# EAGLE design Mosfet Board (EAGLE 9.5.1)
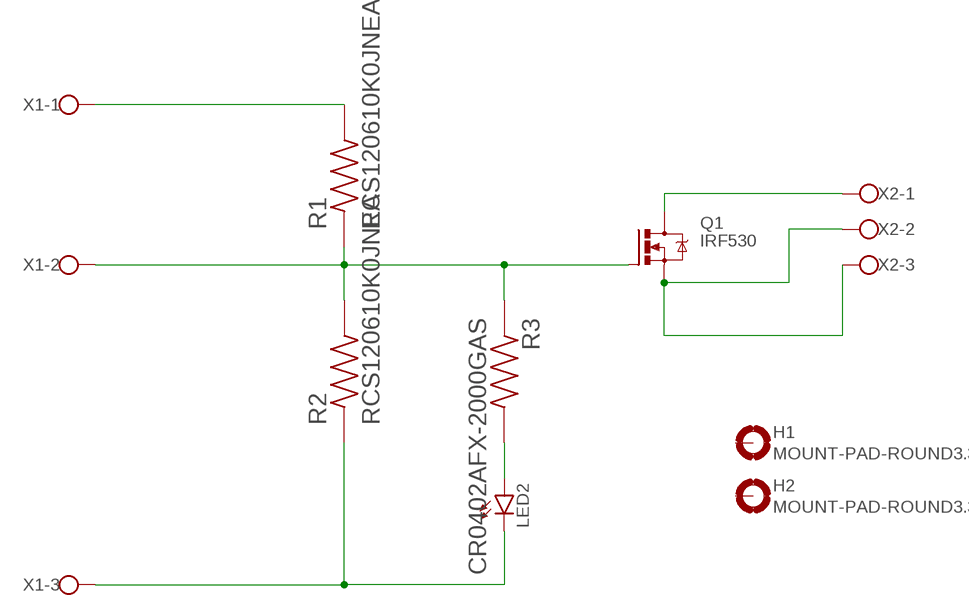
[diagram p0: schematic, sheet 1]

## Parts
H1  MOUNT-PAD-ROUND3.3  [3,3-PAD]
H2  MOUNT-PAD-ROUND3.3  [3,3-PAD]
LED2  LED  [SMARTLED-TTW]
Q1  IRF530  [TO220BV]
R1  RCS120610K0JNEA  [RESC3116X65N]
R2  RCS120610K0JNEA  [RESC3116X65N]
R3  CR0402AFX-2000GAS  [RESC1005X37N]
X1  W237-103  [W237-103]
X2  W237-103  [W237-103]

## Nets
N$1: Q1.D X2.1
N$2: Q1.S X2.2 X2.3
N$3: Q1.G R1.1 R2.2 R3.1 X1.2
N$4: LED2.C@1(C) R2.1 X1.3
N$5: R1.2 X1.1
N$6: LED2.A@1(A) R3.2
Unconnected: H1.B3,3(MOUNT) H2.B3,3(MOUNT)

## Library data of the parts
H1 H2 = holes:MOUNT-PAD-ROUND: MOUNTING PAD, round
LED2 = led:LED: LED OSRAM: - CHIPLED LG R971, LG N971, LY N971, LG Q971, LY Q971, LO R971, LY R971 LH N974, LH R974 LS Q976, LO Q976, LY Q976 LO Q996 - Hyper CHIPLED LW Q18S LB Q993, LB Q99A, LB R99A - SideLED LS A670, LO A670, LY A670, LG A670, LP A670 LB A673, LV A673, LT A673, LW A673 LH A674 LY A675 LS A676, LA A676, LO A676, LY A676, LW A676 LS A679, LY A679, LG A679 - Hyper Micro SIDELED® LS Y876, LA Y876, LO Y876, LY Y876 LT Y87S - SmartLED LW L88C, LW L88S LB L89C, LB L89S, LG L890 LS L89K, LO L89K, LY L89K LS L896, LA L896, LO L896, LY L896 - TOPLED LS T670, LO T670, LY T670, LG T670, LP T670 LSG T670, LSP T670, LSY T670, LOP T670, LYG T670 LG T671, LOG T671, LSG T671 LB T673, LV T673, LT T673, LW T673 LH T674 LS T676, LA T676, LO T676, LY T676, LB T676, LH T676, LSB T676, LW T676 LB T67C, LV T67C, LT T67C, LS T67K, LO T67K, LY T67K, LW E67C LS E67B, LA E67B, LO E67B, LY E67B, LB E67C, LV E67C, LT E67C LW T67C LS T679, LY T679, LG T679 LS T770, LO T770, LY T770, LG T770, LP T770 LB T773, LV T773, LT T773, LW T773 LH T774 LS E675, LA E675, LY E675, LS T675 LS T776, LA T776, LO T776, LY T776, LB T776 LHGB T686 LT T68C, LB T68C - Hyper Mini TOPLED® LB M676 - Mini TOPLED Santana® LG M470 LS M47K, LO M47K, LY M47K Source: http://www.osram.convergy.de LUXEON: - LUMILED® LXK2-PW12-R00, LXK2-PW12-S00, LXK2-PW14-U00, LXK2-PW14-V00 LXK2-PM12-R00, LXK2-PM12-S00, LXK2-PM14-U00 LXK2-PE12-Q00, LXK2-PE12-R00, LXK2-PE12-S00, LXK2-PE14-T00, LXK2-PE14-U00 LXK2-PB12-K00, LXK2-PB12-L00, LXK2-PB12-M00, LXK2-PB14-N00, LXK2-PB14-P00, LXK2-PB14-Q00 LXK2-PR12-L00, LXK2-PR12-M00, LXK2-PR14-Q00, LXK2-PR14-R00 LXK2-PD12-Q00, LXK2-PD12-R00, LXK2-PD12-S00 LXK2-PH12-R00, LXK2-PH12-S00 LXK2-PL12-P00, LXK2-PL12-Q00, LXK2-PL12-R00 Source: www.luxeon.com KINGBRIGHT: KA-3528ASYC Source: www.kingbright.com
Q1 = transistor-power:IRF530: HEXFET Power MOSFET
R1 R2 = RCS120610K0JNEA:RCS120610K0JNEA; AVAILABILITY: Unavailable; DESCRIPTION: RCS1206 200 10K 5% ET1 E3; MF: Vishay; MP: RCS120610K0JNEA; PACKAGE: 3116 Vishay; PRICE: None
R3 = CR0402AFX-2000GAS:CR0402AFX-2000GAS; AVAILABILITY: Unavailable; DESCRIPTION: ResA-AS 0402 200R 1% 63mW TC100; MF: Bourns; MP: CR0402AFX-2000GAS; PACKAGE: 1005 Bourns; PRICE: None
X1 X2 = con-wago-500:W237-103: WAGO SCREW CLAMP; MPN: 237-103; OC_FARNELL: unknown; OC_NEWARK: 18M7116

## Board
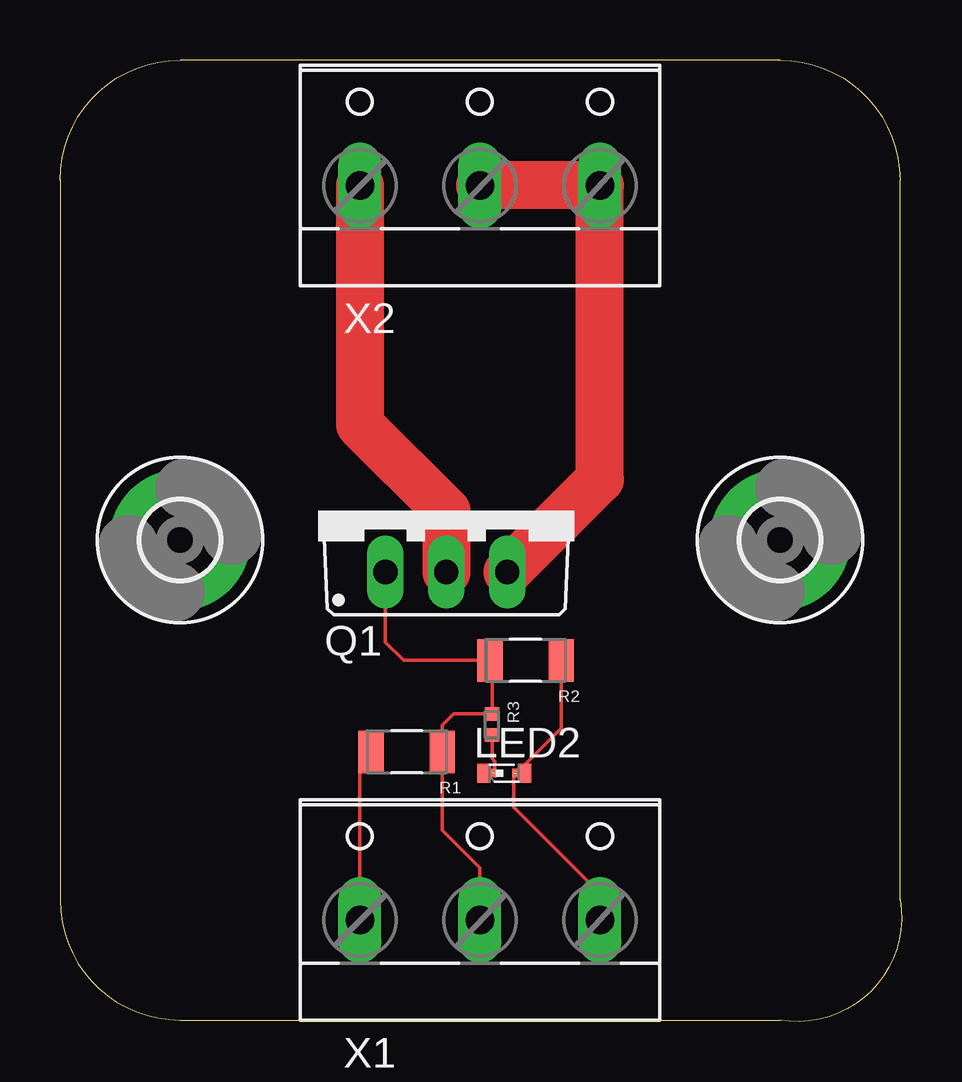
[diagram p1: board, top side]

Size 35.06 x 40.06 mm. Coordinates in mm from the lower left corner, seen from the top.
Outline: 5,0.06 30,0.06 arc110 35,5.06 35,35.06 arc90 30,40.06 5,40.06 arc90 0,35.06 0,5.06 arc90 5,0.06
Copper layers (1*16): Top 0.035mm / dielectric 1.5mm / Bottom 0.035mm
Design rules "default": minimum track width 6mil, minimum drill 0.35mm, track to track 6mil, track to pad 6mil, pad to pad 6mil, via to via 6mil, smd to smd 6mil, copper to edge 40mil, drill to drill 6mil, minimum pad ring 10mil, minimum via ring 8mil, stop-mask expansion 4mil, vias tented up to drill 0mil, thermal gap 10mil

### Footprints (pad centres in the part's own frame; a part is rotated, then mirrored left to right if it is on the bottom)
3,3-PAD = drill 3.3 pad 5.842: B3,3 0,0
SMARTLED-TTW = smd 0.8 x 0.5: A 0,-0.875; C 0,0.875 | smd 0.35 x 0.35: A@1 0,-0.5; C@1 0,0.5
TO220BV = drill 1.016 long: D 0,-2.54; G -2.54,-2.54; S 2.54,-2.54
RESC3116X65N = smd 1.05 x 1.77: 1 -1.485,0; 2 1.485,0
RESC1005X37N = smd 0.56 x 0.6: 1 -0.435,0; 2 0.435,0
W237-103 = drill 1.194 long: 1 -5,-1.29; 2 0,-1.29; 3 5,-1.29

### Placement (x,y rotation side)
H1  30,20.06 0 top
H2  5,20.06 0 top
LED2  18.51,10.35 270 top
Q1  16.1,21.27 0 top
R1  14.45,11.24 180 top
R2  19.4,15.05 180 top
R3  18,12.38 270 top
X1  17.49,5.52 0 top
X2  17.49,36.13 0 top

### Tracks (layer width: path | path; a pad name or v marks a point on that pad's centre or on a via)
N$1
  Top 2: X2.1 12.49,24.87 16.1,21.27 Q1.D
N$2
  Top 2: Q1.S 22.49,22.59 X2.3 X2.2
N$3
  Top 0.152: X1.2 17.49,6.41 15.93,7.98 R1.1 15.93,12.34 16.4,12.82 R3.1 18,14.96 R2.2 14.32,15.05 13.56,15.81 Q1.G
N$4  (1 unrouted)
  Top 0.152: X1.3 22.49,5.35 18.91,8.94 18.91,10.35 | LED2.C@1 20.88,12.22 R2.1
N$5
  Top 0.152: X1.1 12.49,10.77 R1.2
N$6  (1 unrouted)
  Top 0.152: R3.2 18,10.96 18.11,10.84 18.11,10.35